# Altium schematic sheet RTC Clock.SchDoc: RTC Clock
size A4; Date: Dec. 27th, 2022; Author: Karl Asseily; DrawnBy: Karl Asseily; DocumentNumber: 202301140903; Revision: 1.2; SheetNumber: 16; SheetTotal: 20
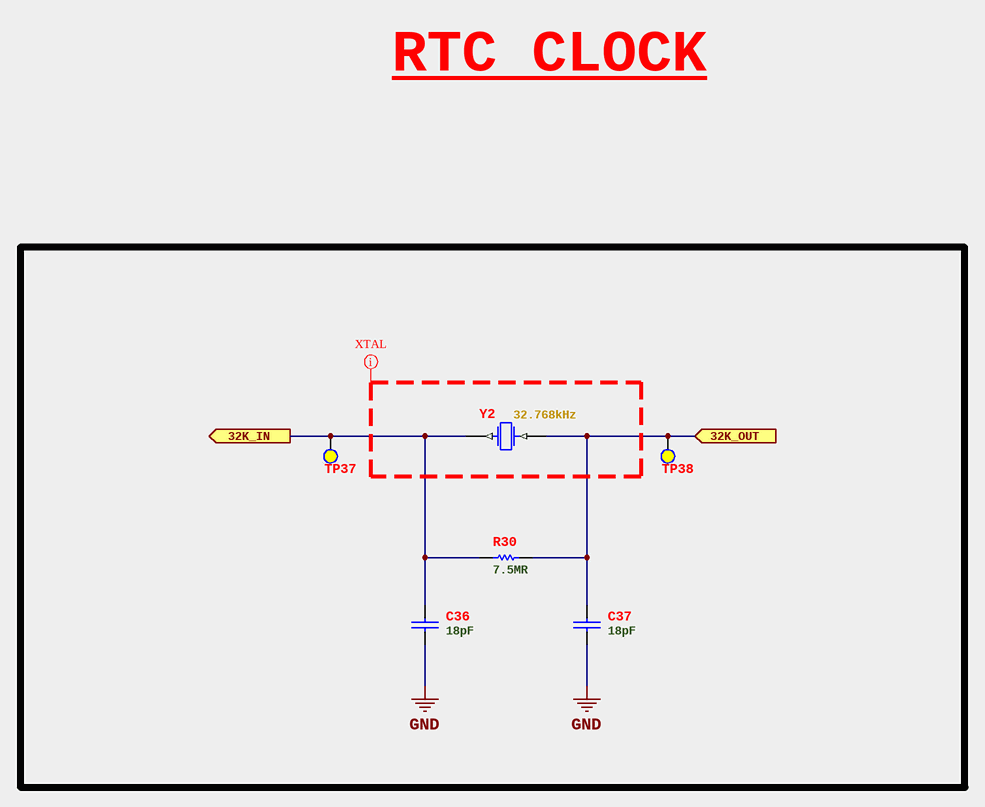
[diagram p0: RTC Clock.SchDoc]

## Parts
C36  18pF  [CAP_0603]
C37  18pF  [CAP_0603]
R30  7.5MR  [RES_0603]
TP37  RTC 32.768KHz IN  [TEST POINT HOLE]  (value not drawn)  (no BOM)
TP38  RTC 32.768KHz OUT  [TEST POINT HOLE]  (value not drawn)  (no BOM)
Y2  Frequency: 32.768kHz  [XTAL_ECX-.327-CDX-1293]  (hidden comment: ECX-.327-CDX-1293)

## Ports
32K_IN (out, see Main Controller Unit, ESP32 Processor), 32K_OUT (in, see Main Controller Unit, ESP32 Processor)

## Nets
GND: C36.2 C37.2
32K_IN: C36.1 R30.1 TP37.TP Y2.1(In/Out) ; port 32K_IN
32K_OUT: C37.1 R30.2 TP38.TP Y2.2(Out/In) ; port 32K_OUT

## Layout directives
net class XTAL; rule Maximum Via Count Constraint [Max Count = 0]: (no net found under the mark)

## Notes on the sheet
- RTC CLOCK
- Project
- Sheet
- Size
- Filename
- A4
- of
- Number
- Drawn By
- Rev.
- Variant
- Date

## Library data of the parts
C36 C37 = CAP_18pf-50V-1%_0603: 18 pF ±1% 50V Ceramic Capacitor C0G, NP0 0603 (1608 Metric); Manufacturer: Yageo; Manufacturer Part Number: CC0603FRNPO9BN180; Supplier 1: Digi-Key; RoHS: Yes; Category: Ceramic Capacitors; Stock 1: 77143; Pricing 1: 1=0.19000, 10=0.13300, 50=0.07560, 100=0.06260, 500=0.04390, 1000=0.03634 (USD); Mounting Technology: Surface Mount; Case/Package: 0603; Case Code (Imperial): 0603; Case Code (Metric): 1608; Min Operating Temperature: -55°C; Max Operating Temperature: 125°C; Tolerance: 1%; Capacitance: 18pF; Dielectric: C0G; Packaging: Tape and Reel; Voltage Rating: 50V; Voltage Rating (DC): 50V; Termination: SMD/SMT; Resistor Type: Ceramic; Series: CC; Length: 1.6mm; Width: 0.031inch; Height: 0.8mm; Thickness: 0.035inch; Depth: 0.8mm; Radiation Hardening: No; Lead Free: Lead Free; RoHS Compliant: Yes; Supplier 2: Mouser; ComponentLink1Description: Datasheet; ComponentLink1URL: C:\Users\Public\Documents\Altium\Projects\Cellar_Watchdog\Docs\Capacitor\UPY-GP_NP0_16V-to-50V_18.pdf; Supplier Part Number 2: 603-CC603FRNPO9BN180; Supplier Part Number 1: 311-3889-1-ND
R30 = RES_7.5MR-100mW-1%_0603: 7.5 MOhms ±1% 0.1W, 1/10W Chip Resistor 0603 (1608 Metric) Moisture Resistant Thick Film; Manufacturer: Yageo; Manufacturer Part Number: RC0603FR-077M5L; Temperature Coefficient: 100ppm/°C; Power Rating: 100mW; Voltage Rating: 50V; Supplier 1: Digi-Key; RoHS: Yes; Category: Chip SMD Resistors; Stock 1: 22856; Pricing 1: 1=0.10000, 10=0.02100, 100=0.00850, 1000=0.00383, 2500=0.00332 (USD); Case/Package: 0603; Contact Plating: Tin,Matte; Case Code (Imperial): 0603; Case Code (Metric): 1608; Min Operating Temperature: -55°C; Max Operating Temperature: 155°C; Resistance: 7.5MR; Tolerance: 1%; Resistor Type: Thick Film; Packaging: Tape and Reel; Termination: SMD/SMT; Number of Terminations: 2; Max Power Dissipation: 100mW; Features: Moisture Resistant; Series: RC; Construction: Rectangular; Length: 1.6mm; Width: 0.8mm; Height: 0.022inch; Depth: 0.8mm; Military Standard: Not; Lead Free: Lead Free; RoHS Compliant: Yes; ComponentLink1URL: C:\Users\Public\Documents\Altium\Projects\Cellar_Watchdog\Docs\Resistor\PYu-RC_Group_51_RoHS_L_12.pdf; ComponentLink1Description: Datasheet; Supplier 2: Mouser; Supplier Part Number 2: 603-RC0603FR-077M5L; Supplier Part Number 1: 13-RC0603FR-077M5LCT-ND
TP37 TP38 = Test Point: PCB Test Point; ClassName: Test Point
  TP37: Value: RTC 32.768KHz IN
  TP38: Value: RTC 32.768KHz OUT
Y2 = XTAL_32.768KHz-12.5pF_2-SMD: 32.768 kHz ±5ppm Crystal 12.5pF 70 kOhms 2-SMD, No Lead; Manufacturer: ECS International; ESR (Equivalent Series Resistance): 70kR; Supplier 1: Digi-Key; Manufacturer Part Number: ECX-.327-CDX-1293; RoHS: Yes; Category: Crystals; Stock 1: 208118; Pricing 1: 1=0.81000, 10=0.72000, 50=0.67320, 100=0.59490, 500=0.56358, 1000=0.46965 (USD); Mount: Surface Mount; Case/Package: SMD/SMT; Min Operating Temperature: -40°C; Max Operating Temperature: 85°C; Packaging: Tape and Reel; Frequency Tolerance: 5ppm; Load Capacitance: 12.5pF; RoHS Compliant: Yes; ComponentLink1URL: C:\Users\Public\Documents\Altium\Projects\Cellar_Watchdog\Docs\Crystal\ECX-.327-CDX-1293.pdf; ComponentLink1Description: Datasheet; Supplier 2: Mouser; Supplier Part Number 2: 520-ECX-.327CDX-1293; Supplier Part Number 1: XC2292CT-ND